# EAGLE schematic ryu (EAGLE 8.2.2)
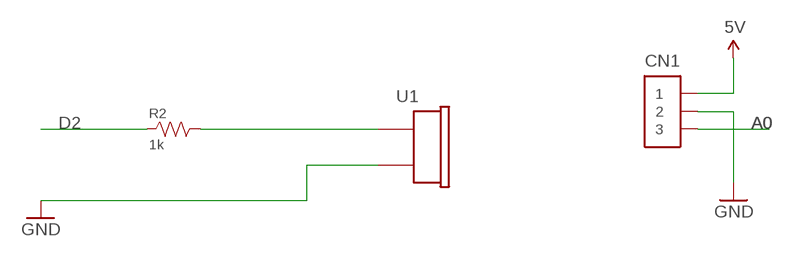
[diagram p0: schematic, sheet 1]

## Parts
CN1  PIN_HEADER_1X3  [PIN_1X3]
R2  1k  RESISTOR-0603  [0603]
U1  BUZZER  [PKM13EPYH4000-A0]

## Nets
5V: CN1.1
A0: CN1.3
D2: R2.1
GND: CN1.2
GND1: U1.2
N$14: R2.2 U1.1

## Library data of the parts
CN1 = FaBo-PIN:PIN_HEADER_1X3
R2 = FaBo-Resistors:RESISTOR: RESISTOR
U1 = FaBo-Parts:BUZZER